# EasyEDA Pro project ProPrj_fallctf2025badge_2025-09-24.epro, schematic esp32-simpler

## Sheets
1 P1: Board Name: esp32-simpler; Create Date: 2025-02-07; Page Name: P1; Project Name: fallctf2025badge; Schematic Name: esp32-simpler; Update Date: 2025-02-23; Company: EasyEDA.com; Page Size: A4; Version: V1.0
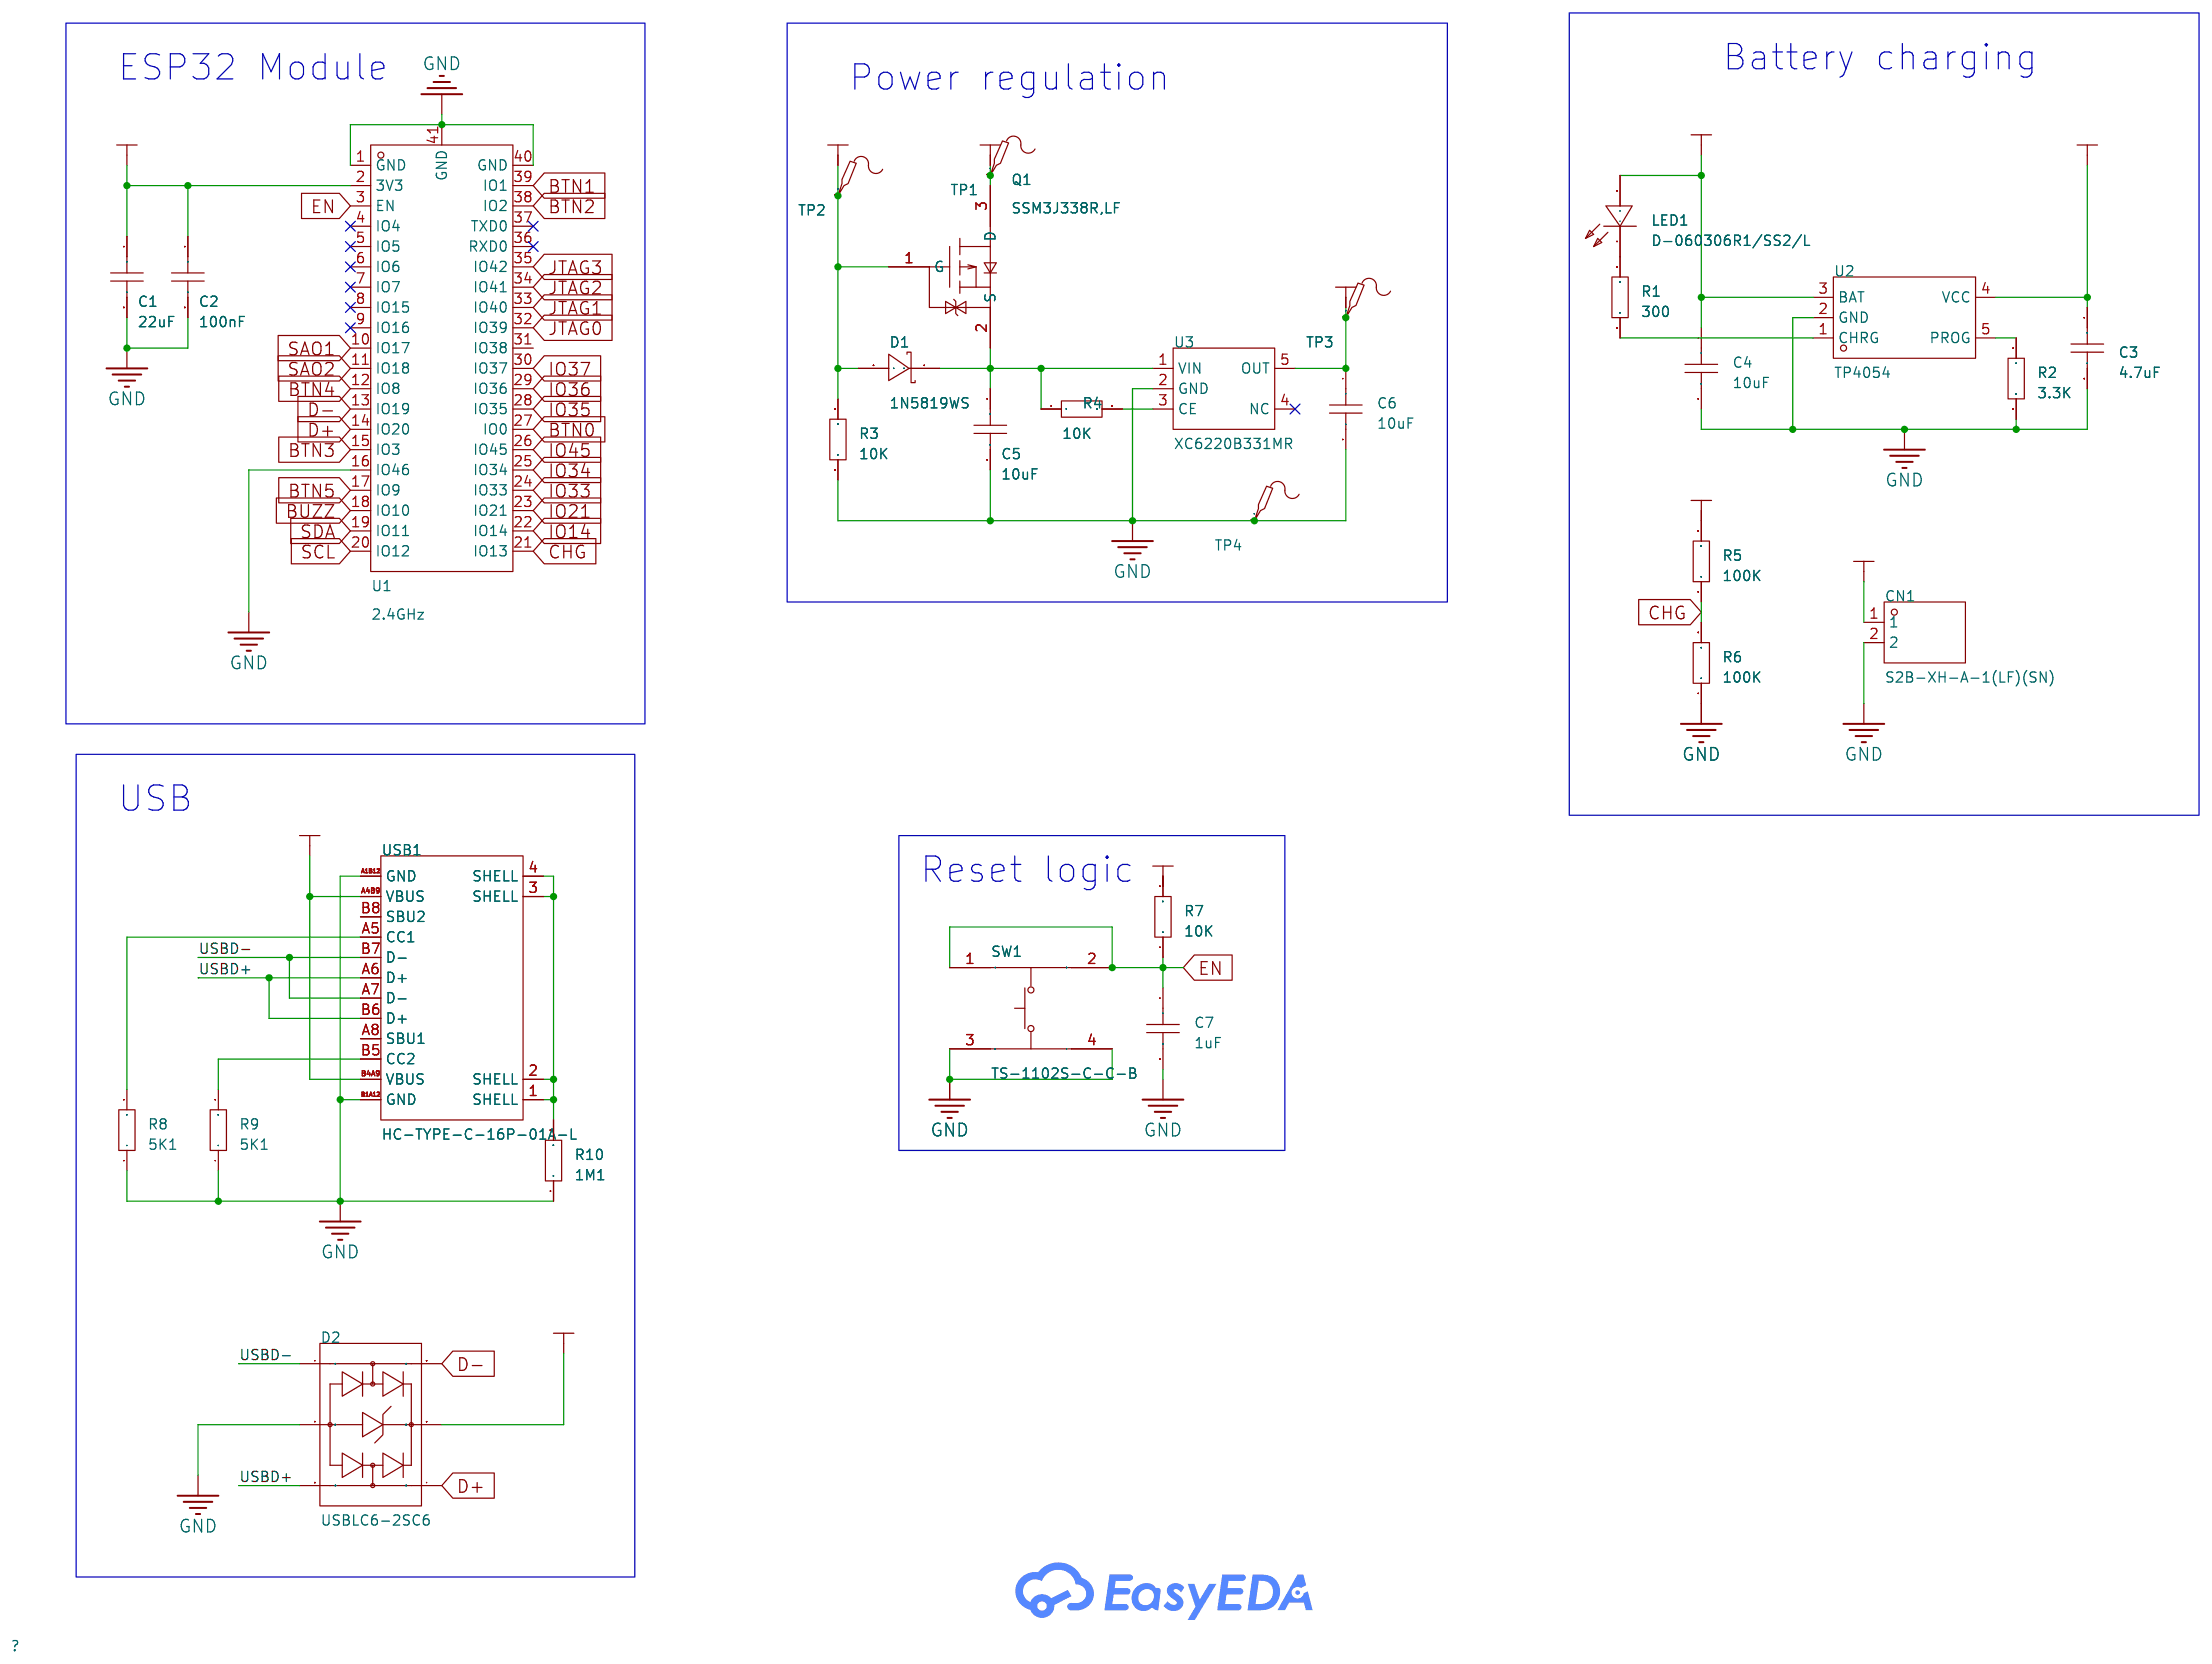
[diagram p0: P1]
2 P2: Page Name: P2; Update Date: 2025-02-22
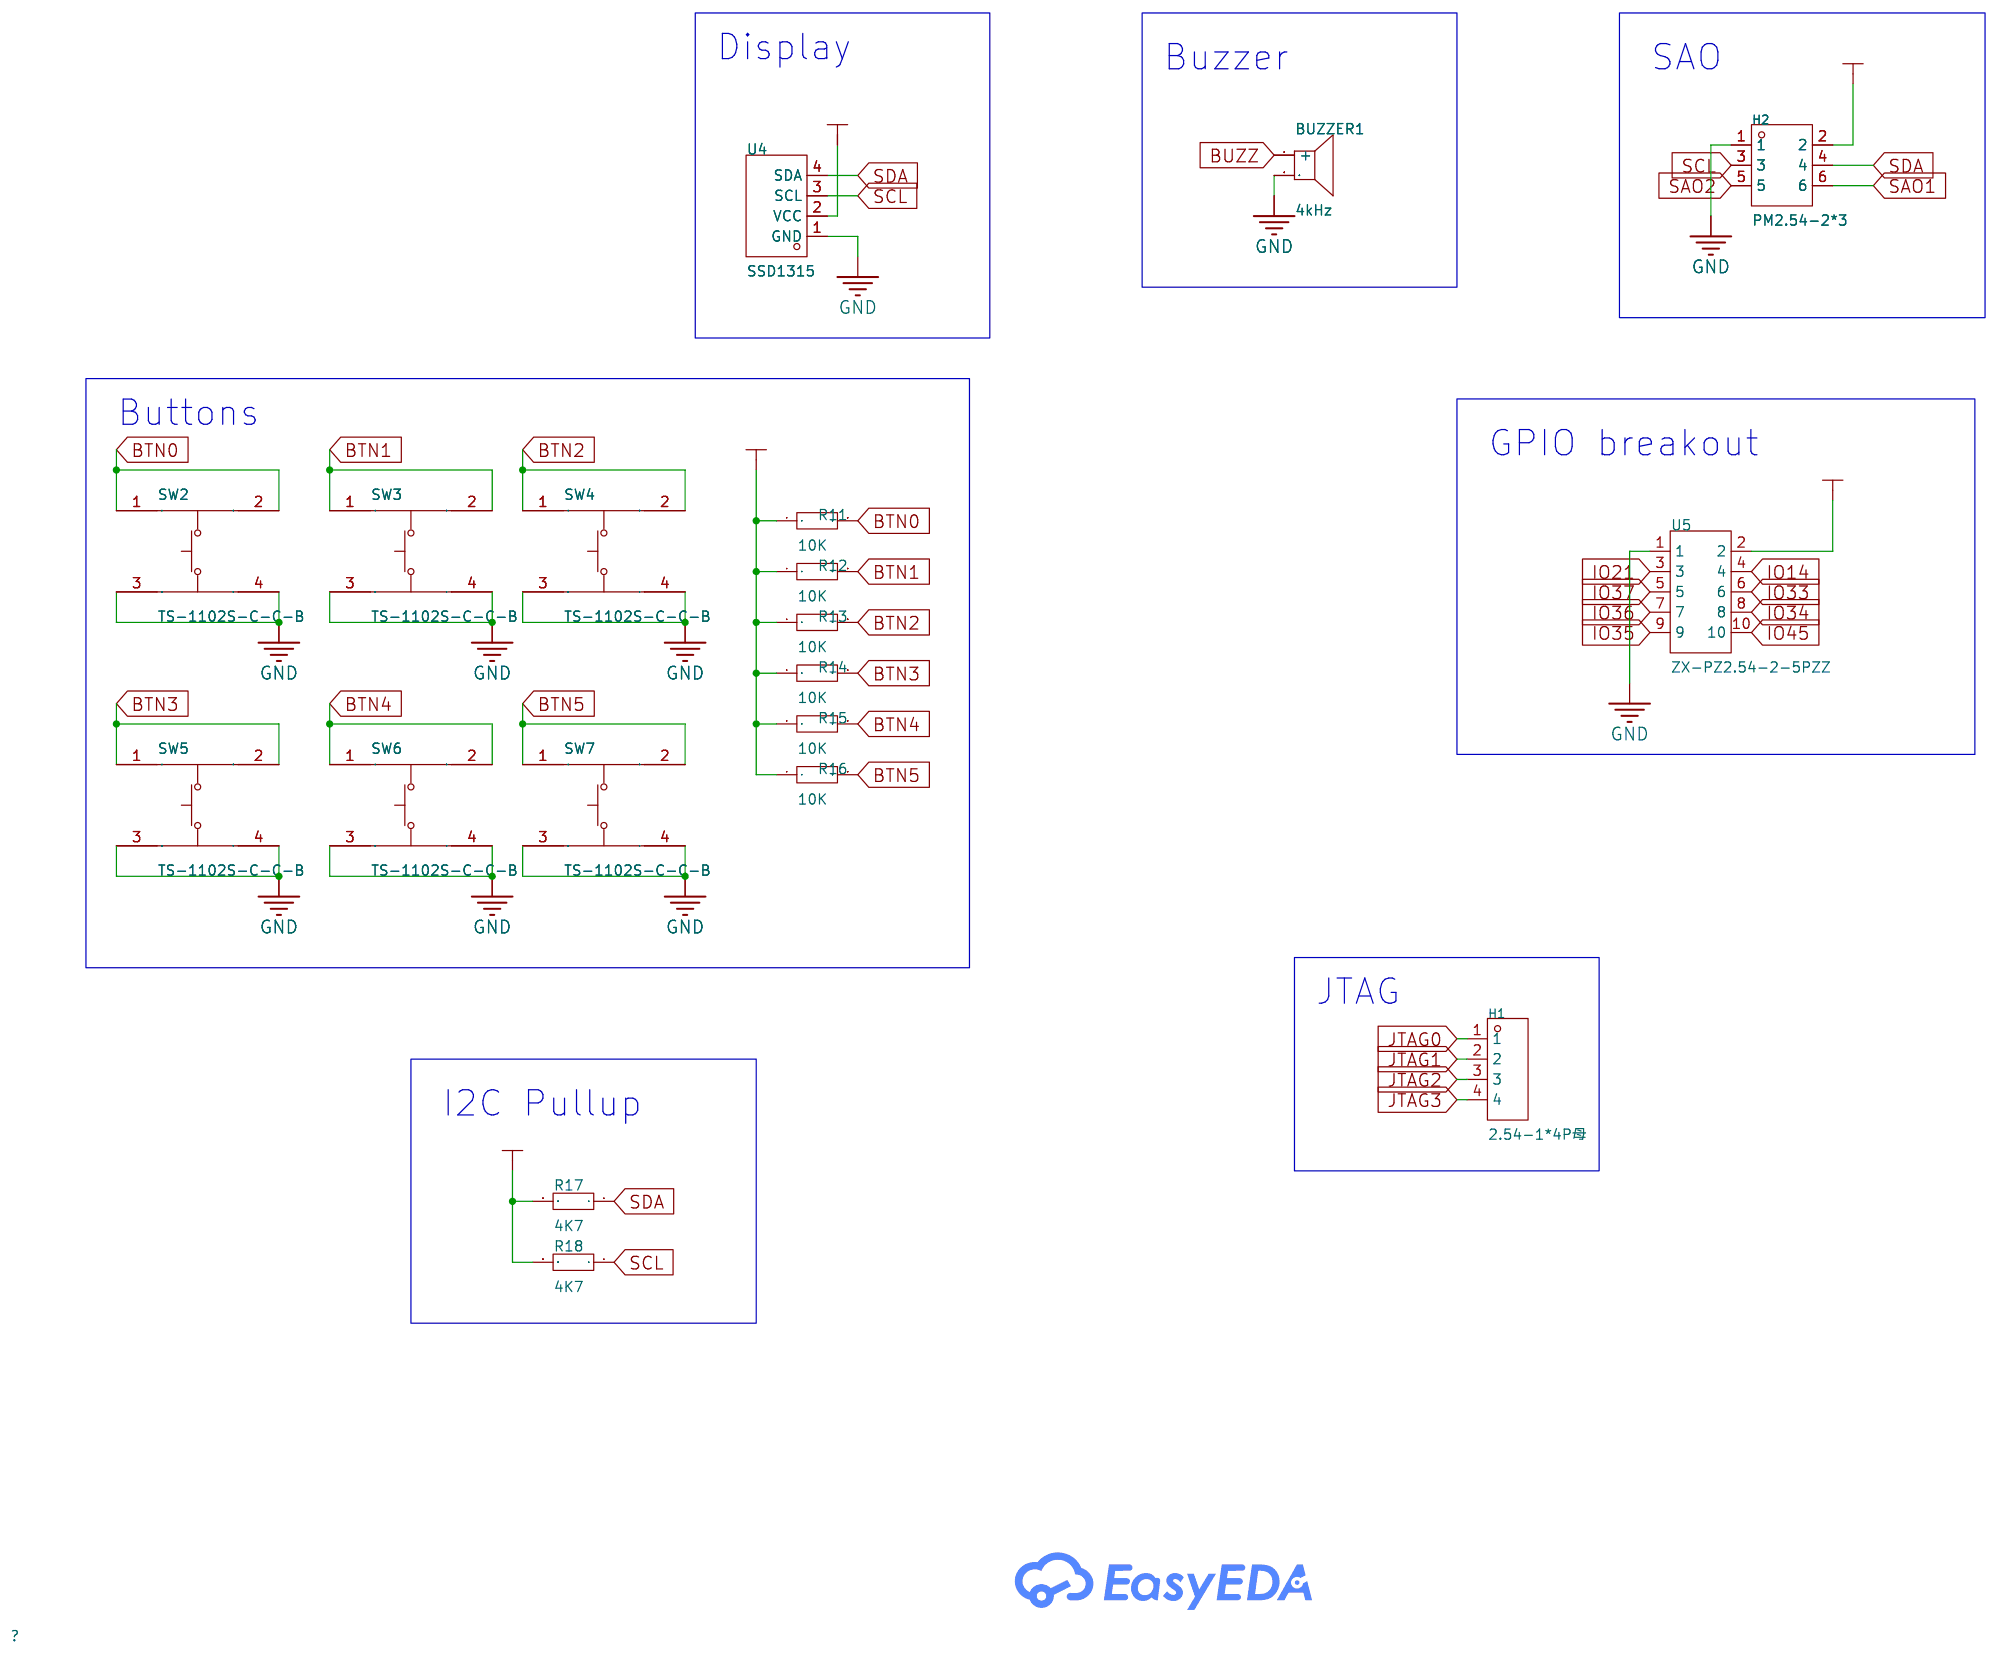
[diagram p1: P2]

## Parts
sheet P1
C1  22uF  [C0603]
C2  100nF  [C0603]
C3  4.7uF  [C0603]
C4  10uF  [C0603]
C5  10uF  [C0603]
C6  10uF  [C0603]
C7  1uF  [C0603]
CN1  S2B-XH-A-1(LF)(SN)  [CONN-TH_S2B-XH-A-1-LF-SN]
D1  1N5819WS  [SOD-323_L1.7-W1.3-LS2.5-RD]
D2  USBLC6-2SC6  [SOT-23-6_L2.9-W1.6-P0.95-LS2.8-BL]
LED1  D-060306R1/SS2/L  [LED0603-RD]
Q1  SSM3J338R,LF  [SOT-23F_L2.9-W1.8-P0.95-LS2.4-BR]
R1  300  [R0603]
R2  3.3K  [R0603]
R3  10K  [R0603]
R4  10K  [R0603]
R5  100K  [R0603]
R6  100K  [R0603]
R7  10K  [R0603]
R8  5K1  [R0603]
R9  5K1  [R0603]
R10  1M1  [R0603]
SW1  TS-1102S-C-C-B  [KEY-SMD_4P-L6.0-W6.0-P4.50-LS8.6]
TP1  -  [Test-Point-0.5mm]
TP2  -  [Test-Point-0.5mm]
TP3  -  [Test-Point-0.5mm]
TP4  -  [Test-Point-0.5mm]
U1  2.4GHz  [WIRELM-SMD_ESP32-S3-WROOM-1]
U2  TP4054  [TSOT-23-5_L2.9-W1.6-P0.95-LS2.8-BR]
U3  XC6220B331MR  [SOT-23-5_L2.9-W1.6-P0.95-LS2.8-BR]
USB1  HC-TYPE-C-16P-01A-L  [USB-C-SMD_G-SWITCH_GT-USB-7010EN]
sheet P2
BUZZER1  4kHz  [BUZ-TH_BD12.5-P5.00-D0.9]
H1  2.54-1*4P母  [HDR-TH_4P-P2.54-V-F]
H2  PM2.54-2*3  [HDR-TH_6P-P2.54-V-F-R2-C3-S2.54]
R11  10K  [R0603]
R12  10K  [R0603]
R13  10K  [R0603]
R14  10K  [R0603]
R15  10K  [R0603]
R16  10K  [R0603]
R17  4K7  [R0603]
R18  4K7  [R0603]
SW2  TS-1102S-C-C-B  [KEY-SMD_4P-L6.0-W6.0-P4.50-LS8.6]
SW3  TS-1102S-C-C-B  [KEY-SMD_4P-L6.0-W6.0-P4.50-LS8.6]
SW4  TS-1102S-C-C-B  [KEY-SMD_4P-L6.0-W6.0-P4.50-LS8.6]
SW5  TS-1102S-C-C-B  [KEY-SMD_4P-L6.0-W6.0-P4.50-LS8.6]
SW6  TS-1102S-C-C-B  [KEY-SMD_4P-L6.0-W6.0-P4.50-LS8.6]
SW7  TS-1102S-C-C-B  [KEY-SMD_4P-L6.0-W6.0-P4.50-LS8.6]
U4  SSD1315  [OLED-TH_L27.8-W27.2-P2.54_C9900033791]
U5  ZX-PZ2.54-2-5PZZ  [HDR-TH_10P-P2.54-V-M-R2-C5-S2.54]

## Library data of the parts
C1-C7 = CAP_0603: Supplier Footprint: 0603
CN1 = S2B-XH-A-1(LF)(SN): Pins Structure:1x2P Pitch:2.5mm Mounting Style:Bend insert Reference Series:XH Number of Pins:2P Number of Rows:1 Number of PINs Per Row:2 Row Spacing:- Current Rating (Max):3A Contact Material:Brass Contact Plating:Tin Operating Temperature Range:-25℃~+8; LCSC Part Name: 1x2P 间距:2.5mm 弯插 系列:XH; Supplier Part: C163035; Manufacturer: JST; Supplier Footprint: 弯插,P=2.5mm; JLCPCB Part Class: Extended Part; Datasheet: https://atta.szlcsc.com/upload/public/pdf/source/20180928/C265283_F9DFEEBDB2CF642B6BDFAB4B77BD2680.pdf; Supplier: LCSC; Pins Structure: 1x2P; Pitch: 2.5mm; Mounting Style: Bend insert; Reference Series: XH; Number of Pins: 2P; Number of Rows: 1; Number of PINs Per Row: 2; Current Rating (Max): 3A; Contact Material: Brass; Contact Plating: Tin; Operating Temperature Range: -25℃~+85℃; Rated Voltage (Max): 250V; Plastic Material: PA66; Flame Retardant Rating: UL94V-0; Supplementary Features: K-leg punch; Colour: White; Z-Height of the Board: 6.1mm; X-Length of Bottom Edge on Board (Spacing Line): 7.4mm; Y-Width of Bottom Edge on Board: 11.5mm
D1 = 1N5819WS_C369937: Forward Voltage (Vf@If):600mV@1A Reverse Voltage (Vr):40V Rectified Current:1A; LCSC Part Name: 电压:40V 电流:1A; Supplier Part: C369937; Manufacturer: KEXIN(科信); Supplier Footprint: SOD-323F; JLCPCB Part Class: Extended Part; Datasheet: https://atta.szlcsc.com/upload/public/pdf/source/20190301/C369937_C58F0182D9B0478A83E17D6C6D6BD755.pdf; Supplier: LCSC; Forward Voltage (Vf@If): 600mV@1A; Reverse Voltage (Vr): 40V; Rectified Current: 1A
D2 = USBLC6-2SC6_C21713975: polarity:Unidirectional Reverse Stand-Off Voltage (Vrwm):5V Maximum Clamping Voltage:18V Peak Pulse Current (Ipp):4.5A Peak Pulse Power Dissipation (Ppp):300W Breakdown Voltage:6V Reverse Leakage Current (Ir):500nA Number of Lines:Dual channel Operating T; LCSC Part Name: 单向 丝印UL26 丝印UL26; Supplier Part: C21713975; Manufacturer: GOODWORK(固得沃克); Supplier Footprint: SOT-23-6L; JLCPCB Part Class: Extended Part; Datasheet: https://atta.szlcsc.com/upload/public/pdf/source/20240416/DC1784C3B6D68689237FB8CB45F3CF87.pdf; Supplier: LCSC; polarity: Unidirectional; Reverse Stand-Off Voltage (Vrwm): 5V; Maximum Clamping Voltage: 18V; Peak Pulse Current (Ipp): 4.5A; Peak Pulse Power Dissipation (Ppp): 300W; Breakdown Voltage: 6V; Reverse Leakage Current (Ir): 500nA; Number of Lines: Dual channel; Operating Temperature: -55℃~+125℃@(Tj); Type: TVS
LED1 = D-060306R1/SS2/L: Emitted Color:Red; Supplier Part: C118330; Manufacturer: ARKLED(方舟); Supplier Footprint: 0603; JLCPCB Part Class: Extended Part; Datasheet: https://atta.szlcsc.com/upload/public/pdf/source/20170925/C118330_1506321367724990123.pdf; Supplier: LCSC; Emitted Color: Red
Q1 = SSM3J338R,LF: Type:1 Piece P-Channel Drain Source Voltage (Vdss): Continuous Drain Current (Id): Drain Source On Resistance (RDS(on)@Vgs,Id):13.9mΩ@6.0A Power Dissipation (Pd): Gate Threshold Voltage (Vgs(th)@Id):0.3V@1mA Total Gate Charge (Qg@Vgs):19.5nC@6V Input Capa; LCSC Part Name: 1个P沟道 耐压:12V 电流:9A; Supplier Part: C146352; Manufacturer: TOSHIBA(东芝); Supplier Footprint: SOT-23F; JLCPCB Part Class: Extended Part; Datasheet: https://atta.szlcsc.com/upload/public/pdf/source/20171211/C146352_15129763789181175383.pdf; Supplier: LCSC; Type: 1 Piece P-Channel; Drain Source On Resistance (RDS(on)@Vgs,Id): 13.9mΩ@6.0A; Gate Threshold Voltage (Vgs(th)@Id): 0.3V@1mA; Total Gate Charge (Qg@Vgs): 19.5nC@6V; Input Capacitance (Ciss@Vds): 1.4nF@6V; Reverse Transfer Capacitance (Crss@Vds): 225pF; Operating Temperature: -55℃~+150℃
R1-R18 = Res_0603: Supplier Footprint: 0603
SW1-SW7 = TS-1102S-C-C-B: Circuit:SPST Actuator Style:Round Button Operating Force:260gf Mounting Style:Brick nogging Switch Length:6mm Switch Width:6mm Switch Height:5mm Strike Gundam:不带 Contact Current:50mA Voltage Rating (DC):12V Insulation Resistance:- Actuator/Cap Color:Black; LCSC Part Name: 6*6*5mm 立贴 轻触开关; Supplier Part: C381039; Manufacturer: XKB Connectivity(中国星坤); Supplier Footprint: SMD; JLCPCB Part Class: Extended Part; Datasheet: https://atta.szlcsc.com/upload/public/pdf/source/20211011/2711A6933F86C308D94098377C07E7B1.pdf; Supplier: LCSC; Circuit: SPST; Actuator Style: Round Button; Operating Force: 260gf; Mounting Style: Brick nogging; Switch Length: 6mm; Switch Width: 6mm; Switch Height: 5mm; Strike Gundam: 不带; Contact Current: 50mA; Voltage Rating (DC): 12V; Actuator/Cap Color: Black; With Lamp: No; Mechanical Life: 30万次; Operating Temperature: -20℃~+70℃
TP1-TP4 = Test-Point: Test Point 测试点
U1 = ESP32-S2-SOLO-2-N4: Core Processor:ESP32-S2 chip Support Interface:I2C；GPIO；SPI；PWM；ADC；UART；USB；I2S Frequency:2.4GHz Output Power:19.5dBm Output Power:19.5dBm; Supplier Part: C3040594; Manufacturer: ESPRESSIF(乐鑫); Supplier Footprint: SMD-41P; JLCPCB Part Class: Extended Part; Datasheet: https://atta.szlcsc.com/upload/public/pdf/source/20241030/23A98F852E1EE1BC8A41B3B2EC18FA38.pdf; Supplier: LCSC; Core Processor: ESP32-S2 chip; Support Interface: I2C；GPIO；SPI；PWM；ADC；UART；USB；I2S; Output Power: 19.5dBm
U2 = TP4054_C668215: Supply Voltage:6.5V Supply Voltage:6.5V Maximum Charge Current:500mA Type of Battery:锂离子/Polymer Number of Cells:1 Number of Cells:1 Operating Temperature:-40℃~+85℃ Operating Temperature:-40℃~+85℃; Supplier Part: C668215; Manufacturer: UMW(友台半导体); Supplier Footprint: SOT-23-5L; JLCPCB Part Class: Extended Part; Datasheet: https://atta.szlcsc.com/upload/public/pdf/source/20231109/1E60770826C4E1A0E5898BBC08FF3A57.pdf; Supplier: LCSC; Supply Voltage: 6.5V; Maximum Charge Current: 500mA; Type of Battery: 锂离子/Polymer; Number of Cells: 1; Operating Temperature: -40℃~+85℃
U3 = XC6220B331MR: Supplier Part: C3040644; Manufacturer: TECH PUBLIC(台舟); Supplier Footprint: SOT-23-5; JLCPCB Part Class: Extended Part; Datasheet: https://atta.szlcsc.com/upload/public/pdf/source/20220630/EC7D0F989934709C5AE69B489B953B17.pdf; Supplier: LCSC
USB1 = HC-TYPE-C-16P-01A-L: Connector Type:Type-C Standard:USB 3.1 Gender:Female Number of Ports:1 Number of Contacts:16P Mounting Style:卧贴 Current Rating - Power (Max):3A Contact Material:高导铜 Contact Plating:Gold Operating Temperature Range:-25℃~+85℃ Operating Temperature Range:-25; LCSC Part Name: Type-C 母 卧贴; Supplier Part: C2997432; Manufacturer: HCTL(华灿天禄); Supplier Footprint: SMD; JLCPCB Part Class: Extended Part; Datasheet: https://atta.szlcsc.com/upload/public/pdf/source/20221116/C788B956BC5B2689BB81EF44F8093A01.pdf; Supplier: LCSC; Connector Type: Type-C; Standard: USB 3.1; Gender: Female; Number of Ports: 1; Number of Contacts: 16P; Mounting Style: 卧贴; Current Rating - Power (Max): 3A; Contact Material: 高导铜; Contact Plating: Gold; Operating Temperature Range: -25℃~+85℃; Soldering Temperature(Max): 260℃
BUZZER1 = PS1240P02CT3: Driver Circuitry:Passive (external drive) Technology:Piezoelectric Voltage - Supply:30V Voltage - Supply:30V Frequency:4kHz Current Consumption:- Sound Pressure Level(SPL):60dB Diameter(φD):12.2mm Length:- Width:- Height:3.5mm Operating Temperature:-10℃~+; LCSC Part Name: 压电式蜂鸣器3V 4KHz 12.2*3.5; Supplier Part: C76873; Manufacturer: TDK; Supplier Footprint: 插件,D=12.2mm; JLCPCB Part Class: Extended Part; Datasheet: https://atta.szlcsc.com/upload/public/pdf/source/20240116/2CD912CB663E801496ACEB70148B4753.pdf; Supplier: LCSC; Driver Circuitry: Passive (external drive); Technology: Piezoelectric; Voltage - Supply: 30V; Sound Pressure Level(SPL): 60dB; Diameter(φD): 12.2mm; Height: 3.5mm; Operating Temperature: -10℃~+70℃
H1 = 2.54-1*4P母: Holes Structure:1x4P Pitch:2.54mm Row Spacing:- Circular Hole / Square Hole:Square Holes Mounting Type:Straight Number of Rows:Plugin Number of Holes:4P Current Rating (Max):3A Voltage Rating (Max):- Holes Direction:Top Insulation Height:- Contact Materia; LCSC Part Name: 间距:2.54mm 1x4P 直插; Supplier Part: C2718488; Manufacturer: BOOMELE(博穆精密); Supplier Footprint: 插件,P=2.54mm; JLCPCB Part Class: Extended Part; Datasheet: https://atta.szlcsc.com/upload/public/pdf/source/20210301/C2718488_F4427B881E42CAA8DDB0B1C12B3A522C.pdf; Supplier: LCSC; Holes Structure: 1x4P; Pitch: 2.54mm; Circular Hole / Square Hole: Square Holes; Mounting Type: Straight; Number of Rows: Plugin; Number of Holes: 4P; Current Rating (Max): 3A; Holes Direction: Top; Contact Material: bronze; Operating Temperature Range: -40℃~+105℃
H2 = PM2.54-2*3: Holes Structure:2x3P Pitch:2.54mm Row Spacing:2.54mm Circular Hole / Square Hole:方孔 Mounting Type:Straight Number of Rows:双排 Number of Holes:6P Current Rating (Max):2.5A Holes Direction:Top Insulation Height:8.5mm Operating Temperature Range:-40℃~+105℃ Op; LCSC Part Name: 间距:2.54mm 2x3P 直插; Supplier Part: C5116527; Manufacturer: ZHOURI(洲日); Supplier Footprint: 插件,P=2.54mm; JLCPCB Part Class: Extended Part; Datasheet: https://atta.szlcsc.com/upload/public/pdf/source/20220729/B685A447B6E7D9EA1A3EF6B07540DD20.pdf; Supplier: LCSC; Holes Structure: 2x3P; Pitch: 2.54mm; Row Spacing: 2.54mm; Circular Hole / Square Hole: 方孔; Mounting Type: Straight; Number of Rows: 双排; Number of Holes: 6P; Current Rating (Max): 2.5A; Holes Direction: Top; Insulation Height: 8.5mm; Operating Temperature Range: -40℃~+105℃
U4 = HS96L03W2C03: Main Control Chip:SSD1315 Interface Type:I2C Size:0.96 Pixel Resolution:128x64 Operating Temperature:-40℃~+70℃ Operating Temperature:-40℃~+70℃; LCSC Part Name: 0.96寸OLED显示屏窄白光IIC; Supplier Part: C5248080; Manufacturer: HS(汉昇); JLCPCB Part Class: Extended Part; Datasheet: https://atta.szlcsc.com/upload/public/pdf/source/20230627/763D01F79A90007632F098068C7C8AD9.pdf; Supplier: LCSC; Interface Type: I2C; Size: 0.96; Pixel Resolution: 128x64; Operating Temperature: -40℃~+70℃
U5 = ZX-PZ2.54-2-5PZZ: Pin Structure:2x5P Pitch:2.54mm Row Spacing:2.54mm Circluar Pins/Square Pins:Square Pins Mounting Type:Straight Number of Rows:双排 Number of Pins:10P Current Rating (Max):3A Voltage Rating (Max):1kV Length of Mating Pin:6mm Insulation Height:2.5mm Length o; LCSC Part Name: 2x5P 间距:2.54mm 方针 直插; Supplier Part: C7501276; Manufacturer: Megastar(兆星); Supplier Footprint: 插件,P=2.54mm; JLCPCB Part Class: Extended Part; Datasheet: https://atta.szlcsc.com/upload/public/pdf/source/20231122/7DD2FA5A7FDBC10CDDB6051CB6BC6AD1.pdf; Supplier: LCSC; Pin Structure: 2x5P; Pitch: 2.54mm; Row Spacing: 2.54mm; Circluar Pins/Square Pins: Square Pins; Mounting Type: Straight; Number of Rows: 双排; Number of Pins: 10P; Current Rating (Max): 3A; Voltage Rating (Max): 1kV; Length of Mating Pin: 6mm; Insulation Height: 2.5mm; Length of End Connection Pin: 3mm; Contact Plating: Gold; Operating Temperature Range: -40℃~+105℃; Color: Black

## Nets
+3.3V: C1.1 C2.1 C6.1 H2.2 R7.2 R11.1 R12.1 R13.1 R14.1 R15.1 R16.1 R17.2 R18.2 TP3.1 U1.2(3V3) U3.5(OUT) U4.2(VCC) U5.2
+5V: C3.1 D1.2(A) D2.5(VBUS) Q1.1(G) R3.2 TP2.1 U2.4(VCC) USB1.A4B9(VBUS) USB1.B4A9(VBUS)
GND: BUZZER1.2 C1.2 C2.2 C3.2 C4.2 C5.2 C6.2 C7.2 CN1.2 D2.2(GND) H2.1 R2.2 R3.1 R6.1 R8.1 R9.1 R10.1 SW1.3 SW1.4 SW2.3 SW2.4 SW3.3 SW3.4 SW4.3 SW4.4 SW5.3 SW5.4 SW6.3 SW6.4 SW7.3 SW7.4 TP4.1 U1.1(GND) U1.16(IO46) U1.40(GND) U1.41(GND) U2.2(GND) U3.2(GND) U4.1(GND) U5.1 USB1.A1B12(GND) USB1.B1A12(GND)
VBAT: C4.1 CN1.1 LED1.2(+) Q1.3(D) R5.2 TP1.1 U2.3(BAT)
BTN0: R11.2 SW2.1 SW2.2 U1.27(IO0)
BTN1: R12.2 SW3.1 SW3.2 U1.39(IO1)
BTN2: R13.2 SW4.1 SW4.2 U1.38(IO2)
BTN3: R14.2 SW5.1 SW5.2 U1.15(IO3)
BTN4: R15.2 SW6.1 SW6.2 U1.12(IO8)
BTN5: R16.2 SW7.1 SW7.2 U1.17(IO9)
BUZZ: BUZZER1.1(+) U1.18(IO10)
CHG: R5.1 R6.2 U1.21(IO13)
D+: D2.4(I/O2) U1.14(IO20)
D-: D2.6(I/O1) U1.13(IO19)
EN: C7.1 R7.1 SW1.1 SW1.2 U1.3(EN)
IO14: U1.22(IO14) U5.4
IO21: U1.23(IO21) U5.3
IO33: U1.24(IO33) U5.6
IO34: U1.25(IO34) U5.8
IO35: U1.28(IO35) U5.9
IO36: U1.29(IO36) U5.7
IO37: U1.30(IO37) U5.5
IO45: U1.26(IO45) U5.10
JTAG0: H1.1 U1.32(IO39)
JTAG1: H1.2 U1.33(IO40)
JTAG2: H1.3 U1.34(IO41)
JTAG3: H1.4 U1.35(IO42)
SAO1: H2.6 U1.10(IO17)
SAO2: H2.5 U1.11(IO18)
SCL: H2.3 R18.1 U1.20(IO12) U4.3(SCL)
SDA: H2.4 R17.1 U1.19(IO11) U4.4(SDA)
USBD+: D2.3(I/O2) USB1.A6(D+) USB1.B6(D+)
USBD-: D2.1(I/O1) USB1.A7(D-) USB1.B7(D-)
$1N7837: R9.2 USB1.B5(CC2)
$1N7842: R8.2 USB1.A5(CC1)
$1N22734: R1.2 U2.1(CHRG)
$1N22902: R2.1 U2.5(PROG)
$1N23146: R4.2 U3.3(CE)
$1N23155: C5.1 D1.1(K) Q1.2(S) R4.1 U3.1(VIN)
$1N29633: LED1.1(-) R1.1
$1N31344: R10.2 USB1.1(SHELL) USB1.2(SHELL) USB1.3(SHELL) USB1.4(SHELL)

Not connected (* = marked no-connect by the designer): U1 4(IO4)* 5(IO5)* 6(IO6)* 7(IO7)* 8(IO15)* 9(IO16)* 31(IO38) 36(RXD0)* 37(TXD0)*; U3 4(NC)*; USB1 A8(SBU1) B8(SBU2)

## Notes on the sheets
sheet 1
- ESP32 Module
- Power regulation
- Battery charging
- USB
- Reset logic
sheet 2
- Display
- Buzzer
- SAO
- Buttons
- GPIO breakout
- JTAG
- I2C Pullup
